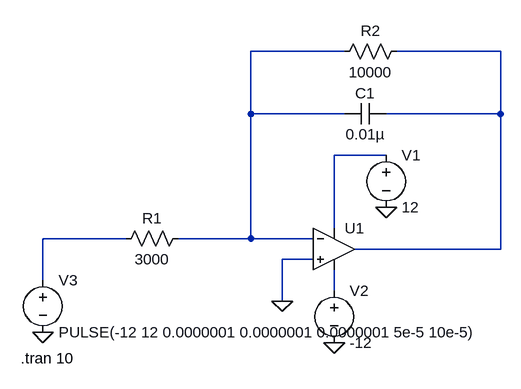
[diagram p0: schematic integrator.asc]
integrator.asc, the LTspice schematic file:
Version 4
SHEET 1 880 680
WIRE 96 -128 -48 -128
WIRE 336 -128 176 -128
WIRE -48 -32 -48 -128
WIRE 96 -32 -48 -32
WIRE 336 -32 336 -128
WIRE 336 -32 160 -32
WIRE 160 32 80 32
WIRE 80 144 80 32
WIRE -240 160 -368 160
WIRE -48 160 -48 -32
WIRE -48 160 -160 160
WIRE 48 160 -48 160
WIRE 336 176 336 -32
WIRE 336 176 112 176
WIRE 48 192 0 192
WIRE -368 224 -368 160
WIRE 80 240 80 208
WIRE 0 256 0 192
FLAG 160 112 0
FLAG 80 320 0
FLAG 0 256 0
FLAG -368 304 0
SYMBOL voltage 160 16 R0
WINDOW 123 0 0 Left 2
WINDOW 39 0 0 Left 2
SYMATTR InstName V1
SYMATTR Value 12
SYMBOL voltage 80 224 R0
WINDOW 123 0 0 Left 2
WINDOW 39 0 0 Left 2
SYMATTR InstName V2
SYMATTR Value -12
SYMBOL Opamps\\UniversalOpamp2 80 176 R0
SYMATTR InstName U1
SYMBOL res -144 144 R90
WINDOW 0 0 56 VBottom 2
WINDOW 3 32 56 VTop 2
SYMATTR InstName R1
SYMATTR Value 3000
SYMBOL cap 160 -48 R90
WINDOW 0 0 32 VBottom 2
WINDOW 3 32 32 VTop 2
SYMATTR InstName C1
SYMATTR Value 0.01µ
SYMBOL voltage -368 208 R0
WINDOW 123 0 0 Left 2
WINDOW 39 0 0 Left 2
SYMATTR InstName V3
SYMATTR Value PULSE(-12 12 0.0000001 0.0000001 0.0000001 5e-5 10e-5)
SYMBOL res 192 -144 R90
WINDOW 0 0 56 VBottom 2
WINDOW 3 32 56 VTop 2
SYMATTR InstName R2
SYMATTR Value 10000
TEXT -402 344 Left 2 !.tran 10

The netlist it stands for:
* integrator.asc
V1 N003 0 12
V2 N005 0 -12
XU1 0 N001 N003 N005 N002 level.2 Avol=1Meg GBW=10Meg Slew=10Meg ilimit=25m rail=0 Vos=0 phimargin=45 en=0 enk=0 in=0 ink=0 Rin=500Meg  ; pins IN+ IN- V+ V- OUT
R1 N001 N004 3000
C1 N002 N001 0.01µ
V3 N004 0 PULSE(-12 12 0.0000001 0.0000001 0.0000001 5e-5 10e-5)
R2 N002 N001 10000
.tran 10
.lib UniversalOpamps2.sub
.backanno
.end